# Altium schematic sheet FPGA_165B_DigitalIO.SchDoc: LiveDesign Evaluation - Digital IO
size B; Organization: Altium Limited; Address1: L3, 12a Rodborough Rd; Address2: Frenchs Forest; Address3: NSW; Address4: Australia 2086; DocumentNumber: 1; SheetNumber: 1; SheetTotal: 1
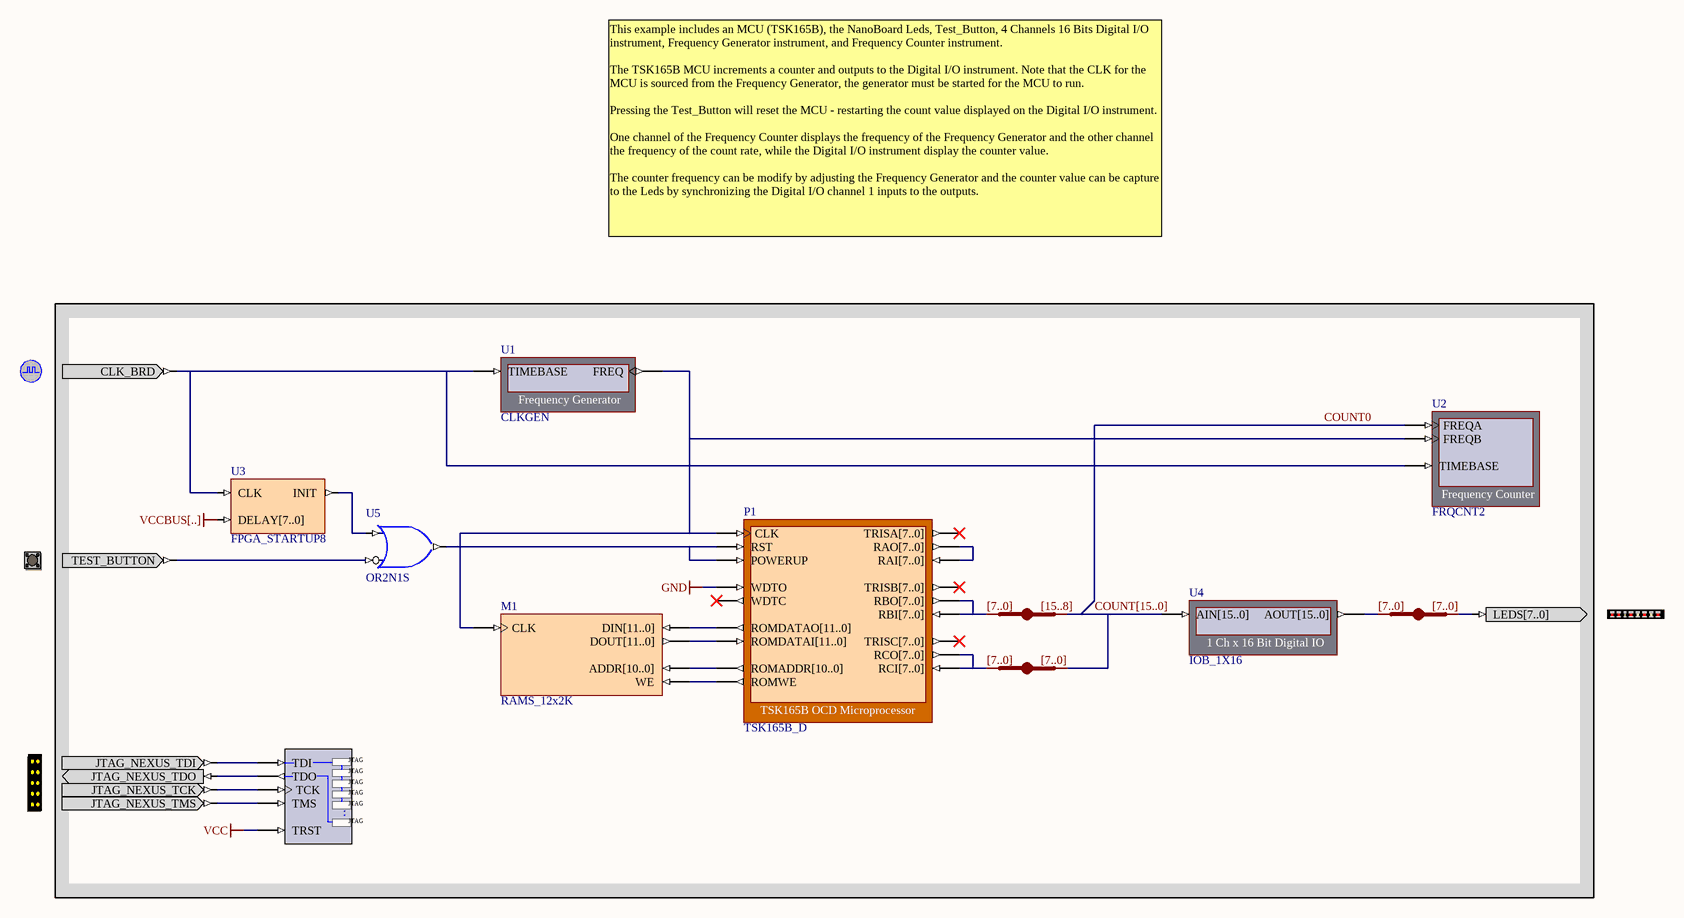
[diagram p0: FPGA_165B_DigitalIO.SchDoc]

## Parts
CLOCK_BOARD  CLOCK_BOARD  (value not drawn)
JB_AUTO1  IndexA: [7..0]  IndexB: [15..8]  (hidden comment: JB)
JB_AUTO2  IndexA: [7..0]  (hidden comment: JB)
JB_AUTO3  IndexA: [7..0]  (hidden comment: JB)
LED  LED  (value not drawn)
M1  RAMS_12x2K
NEXUS_JTAG_CONNECTOR  NEXUS_JTAG_CONNECTOR  (value not drawn)
NEXUS_JTAG_PORT  NEXUS_JTAG_PORT  (value not drawn)
P1  TSK165B_D
TEST_BUTTON  TEST_BUTTON  (value not drawn)
U1  CLKGEN
U2  FRQCNT2
U3  FPGA_STARTUP8
U4  IOB_1X16
U5  OR2N1S

## Nets
GND: P1.WDTO
VCC: NEXUS_JTAG_PORT.TRST
VCCBUS[..]: U3.DELAY[7..0]
COUNT0: U2.FREQA
COUNT[15..0]: JB_AUTO1.B[0..0] JB_AUTO2.B[0..0] U4.AIN[15..0]
NetCLOCK_BOARD_CLK_BRD: CLOCK_BOARD.CLK_BRD U1.TIMEBASE U2.TIMEBASE U3.CLK
NetJB_AUTO1_A[0..0]: JB_AUTO1.A[0..0] P1.RBI[7..0] P1.RBO[7..0]
NetJB_AUTO2_A[0..0]: JB_AUTO2.A[0..0] P1.RCI[7..0] P1.RCO[7..0]
NetJB_AUTO3_A[0..0]: JB_AUTO3.A[0..0] U4.AOUT[15..0]
NetJB_AUTO3_B[0..0]: JB_AUTO3.B[0..0] LED.LEDS[7..0]
NetM1_ADDR[10..0]: M1.ADDR[10..0] P1.ROMADDR[10..0]
NetM1_CLK: M1.CLK P1.CLK U1.FREQ U2.FREQB
NetM1_DIN[11..0]: M1.DIN[11..0] P1.ROMDATAO[11..0]
NetM1_DOUT[11..0]: M1.DOUT[11..0] P1.ROMDATAI[11..0]
NetM1_WE: M1.WE P1.ROMWE
NetNEXUS_JTAG_CONNECTOR_JTAG_NEXUS_TCK: NEXUS_JTAG_CONNECTOR.JTAG_NEXUS_TCK NEXUS_JTAG_PORT.TCK
NetNEXUS_JTAG_CONNECTOR_JTAG_NEXUS_TDI: NEXUS_JTAG_CONNECTOR.JTAG_NEXUS_TDI NEXUS_JTAG_PORT.TDI
NetNEXUS_JTAG_CONNECTOR_JTAG_NEXUS_TDO: NEXUS_JTAG_CONNECTOR.JTAG_NEXUS_TDO NEXUS_JTAG_PORT.TDO
NetNEXUS_JTAG_CONNECTOR_JTAG_NEXUS_TMS: NEXUS_JTAG_CONNECTOR.JTAG_NEXUS_TMS NEXUS_JTAG_PORT.TMS
NetP1_POWERUP: P1.POWERUP P1.RST U5.O
NetP1_RAI[7..0]: P1.RAI[7..0] P1.RAO[7..0]
NetTEST_BUTTON_TEST_BUTTON: TEST_BUTTON.TEST_BUTTON U5.I0
NetU3_INIT: U3.INIT U5.I1

Not connected (* = marked no-connect by the designer): P1 TRISA[7..0]* TRISB[7..0]* TRISC[7..0]* WDTC*

## Buses and harness runs
bus COUNT[15..0]

## Notes on the sheet
- This example includes an MCU (TSK165B), the NanoBoard Leds, Test_Button, 4 Channels 16 Bits Digital I/O instrument, Frequency Generator instrument, and Frequency Counter instrument.
  The TSK165B MCU increments a counter and outputs to the Digital I/O instrument. Note that the CLK for the MCU is sourced from the Frequency Generator, the generator must be started for the MCU to run.
  Pressing the Test_Button will reset the MCU - restarting the count value displayed on the Digital I/O instrument.
  One channel of the Frequency Counter displays the frequency of the Frequency Generator and the other channel the frequency of the count rate, while the Digital I/O instrument display the counter value.
  The counter frequency can be modify by adjusting the Frequency Generator and the counter value can be capture to the Leds by synchronizing the Digital I/O channel 1 inputs to the outputs.
- Title
- Size:
- Date:
- B
- Number:
- Time:
- Revision:
- Sheet
- of
- File:
- (in symbol NEXUS_JTAG_PORT) JTAG; .

## Library data of the parts
CLOCK_BOARD = CLOCK_BOARD: Global System Clock Supply; PortComponent: True; Published: 19-Nov-2003; Publisher: Altium Limited
JB_AUTO1-JB_AUTO3 = JB: System BUS Joiner; Published: 29-Jan-2004; Publisher: Altium Limited; Core Revision: 1.00.00
  JB_AUTO2 JB_AUTO3: IndexB: [7..0]
LED = LED: 8-Way LEDS; PortComponent: True; Published: 19-Nov-2003; Publisher: Altium Limited
M1 = RAMS_12x2K: Single Port RAM; Memory_Depth: 2048; Memory_Type: RAM_SinglePortBlock; Memory_Width: 12; Memory_ClockEdge: Rising; Nexus_Core: Memory_Program; Memory_EnablePin: False; Published: 23/04/2004; Publisher: Altium Hobart Technology Center
NEXUS_JTAG_CONNECTOR = NEXUS_JTAG_CONNECTOR: JTAG Port; PortComponent: True; Published: 19-Nov-2003; Publisher: Altium Limited
NEXUS_JTAG_PORT = NEXUS_JTAG_PORT: Soft Nexus-Chain Connector; NEXUS_JTAG_CONNECTOR: True; Published: 18-Dec-2003; Publisher: Altium Limited
P1 = TSK165B_D: TSK165B OCD Microprocessor; NEXUS_CORE: Processor_OCDS; NEXUS_JTAG_DEVICE: True; NEXUS_JTAG_ORDER: 0; ChildModel1: TSK165B_D_RAM128x8; ChildCore1: M1; Published: 18/12/2003; Publisher: Altium Hobart Technology Centre; Core Revision: 1.00.00
TEST_BUTTON = TEST_BUTTON: Test Button; PortComponent: True; Published: 19-Nov-2003; Publisher: Altium Limited
U1 = CLKGEN: Frequency Generator; NEXUS_CORE: Instrument; NEXUS_JTAG_DEVICE: True; NEXUS_JTAG_ORDER: 0; Published: 18/12/2003; Publisher: Altium Hobart Technology Centre; Core Revision: 1.00.00
U2 = FRQCNT2: Frequency Counter; NEXUS_CORE: Instrument; NEXUS_JTAG_DEVICE: True; NEXUS_JTAG_ORDER: 0; Published: 18/12/2003; Publisher: Altium Hobart Technology Centre; Core Revision: 1.00.00
U3 = FPGA_STARTUP8: FPGA Startup With 8 Bit Delay; Published: 21/01/2004; Publisher: Altium Hobart Technology Centre; Core Revision: 1.00.00
U4 = IOB_1X16: 1 Ch x 16 Bit Digital IO; NEXUS_CORE: Instrument; NEXUS_JTAG_DEVICE: True; NEXUS_JTAG_ORDER: 0; Published: 30/09/2003; Publisher: Altium Hobart Technology Centre; Core Revision: 1.00.00
U5 = OR2N1S: 2-Input OR Gate with Active Low A Input, Single Pin Version; Xilinx Equivalent: OR2B1; ArchiveName: GENERIC; VHDLIB_SIM: GENERIC_LIB; Published: 29-Jan-2004; Publisher: Altium Limited; Core Revision: 1.00.00